# Altium schematic sheet ratopus.schdoc: RaToPUS DC/DC: Top Level Schematic
size A4; Organization: BE-CO-HT, CERN; Address1: Esplanade des Particules 1; Address2: 1217 Meyrin, Switzerland; Revision: 0.3; SheetNumber: 1; SheetTotal: 3; Author: Lalit Patnaik
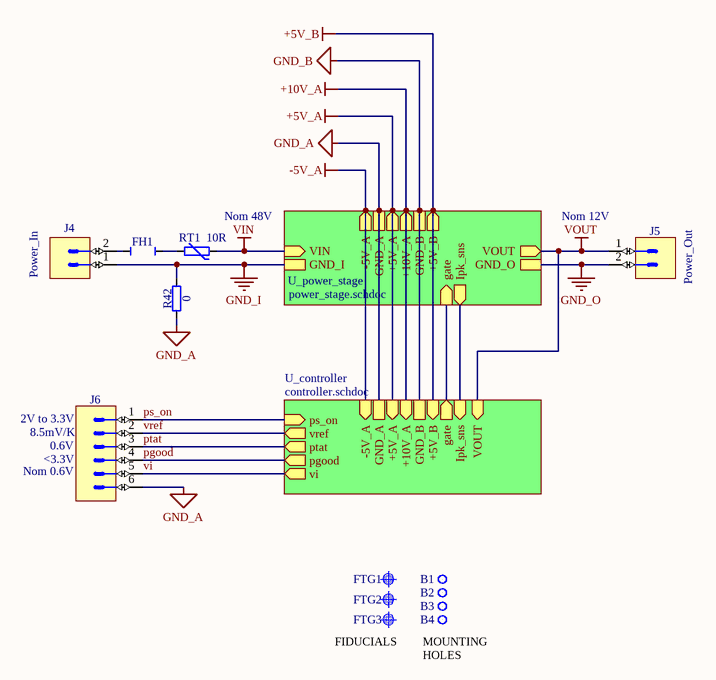
[diagram p0: ratopus.schdoc]

## Parts
B1  Non Plated Hole  [MTG270]  (value not drawn)
B2  Non Plated Hole  [MTG270]  (value not drawn)
B3  Non Plated Hole  [MTG270]  (value not drawn)
B4  Non Plated Hole  [MTG270]  (value not drawn)
FH1  Fuse Holder  [FUSH_SCHURTER_0031.7601]  (value not drawn)
FTG1  Use only in PCB  [FIDUCIAL_TOP_C100-200]  (value not drawn)
FTG2  Use only in PCB  [FIDUCIAL_TOP_C100-200]  (value not drawn)
FTG3  Use only in PCB  [FIDUCIAL_TOP_C100-200]  (value not drawn)
J4  (no value)  [PHOENIX_1755736]
J5  (no value)  [PHOENIX_1755736]
J6  Header 6  [JST_B6B-XH-A(LF)(SN)]  (value not drawn)
R42  0  [RESC2012X60N]
RT1  10R  [THERM_TDK_B57236S0]

## Sub-sheets
U_controller = controller.schdoc: VOUT (in), +5V_A (in), +5V_B (in), +10V_A (in), vref (out), ptat (out), pgood (out), vi (out), GND_A, ps_on (in), gate (out), -5V_A (in), Ipk_sns (in), GND_B
U_power_stage = power_stage.schdoc: gate (in), Ipk_sns (out), VIN (in), VOUT (out), +10V_A (out), -5V_A (out), GND_I, GND_O, GND_A, +5V_A (out), +5V_B (out), GND_B

## Nets
+5V_A: sheet U_power_stage/+5V_A, sheet U_controller/+5V_A
+5V_B: sheet U_power_stage/+5V_B, sheet U_controller/+5V_B
+10V_A: sheet U_power_stage/+10V_A, sheet U_controller/+10V_A
-5V_A: sheet U_power_stage/-5V_A, sheet U_controller/-5V_A
GND_A: J6.6 R42.1 ; sheet U_power_stage/GND_A, sheet U_controller/GND_A
GND_B: sheet U_power_stage/GND_B, sheet U_controller/GND_B
GND_I: J4.1 R42.2 ; sheet U_power_stage/GND_I
GND_O: J5.2 ; sheet U_power_stage/GND_O
VIN: RT1.2 ; sheet U_power_stage/VIN
VOUT: J5.1 ; sheet U_power_stage/VOUT, sheet U_controller/VOUT
pgood: J6.4 ; sheet U_controller/pgood
ps_on: J6.1 ; sheet U_controller/ps_on
ptat: J6.3 ; sheet U_controller/ptat
vi: J6.5 ; sheet U_controller/vi
vref: J6.2 ; sheet U_controller/vref
NetFH1_1: FH1.1 J4.2
NetFH1_2: FH1.2 RT1.1
(unnamed): sheet U_power_stage/gate, sheet U_controller/gate
(unnamed): sheet U_power_stage/Ipk_sns, sheet U_controller/Ipk_sns

Not connected (* = marked no-connect by the designer): B1 1; B2 1; B3 1; B4 1

## Notes on the sheet
- (near RT1) Nom 48V
- (near J5) Nom 12V
- (near J4) Power_In
- (near J5) Power_Out
- (near J6) 2V to 3.3V
- (near J6) 8.5mV/K
- (near J6) 0.6V
- (near J6) Nom 0.6V
- (near J6) <3.3V
- (near FTG3) FIDUCIALS
- (near B4) MOUNTING HOLES
- Title
- Size:
- Date:
- A4
- Number:
- Time:
- Revision:
- Sheet
- of
- File:

## Library data of the parts
B1-B4 = NON-PLATED_HOLE2.7: Single Terminal Socket; Part Description: Non Plated Through Hole: Hole Dia.=2.7mm; Mounted: No; Part Number: NON-PLATED_HOLE2.7; Component Kind: Standard (No BOM); Component Type: Standard (No BOM); Pin Count: 1; Family: Non Plated Hole; Socket: No; SMD: No; Sense: No; Status: None; ComponentHeight: 0mm; HelpURL: Undefined; Author: CERN DEM BC; CreateDate: 11/11/2015; LatestRevisionDate: 11/11/2015; PackageDescription: Non Plated Through Hole: Hole Dia.=2.7mm
FH1 = FUSH_SCHURTER_0031.7601: Part Description: Vertical Fuse Holder For D8.5 x H8.5mm Subminiature Fuses; PressFit: No; Part Number: FUSH_SCHURTER_0031.7601; Component Kind: Standard; Component Type: Standard; Pin Count: 2; PackageDescription: Vertical Fuse Holder For D8.5x H 8.5mm Subminiature Fuses; Family: Fuse Holder; Mounted: Yes; Socket: No; SMD: No; Sense: No; Manufacturer: SCHURTER; Manufacturer Part Number: 0031.7601; ComponentHeight: 4.4mm; HelpURL: \\cern.ch\dfs\Applications\Altium\Datasheets\FUSH_SCHURTER_0031.7601.pdf; Author: CERN DEM JLC; CreateDate: 12/09/2012; LatestRevisionDate: 12/09/2012
FTG1-FTG3 = FIDUCIAL_TARGET_C100-200: Fiducial Target; Part Description: Round Fiducial Target, Top Layer, 1.0mm, Top Solder 2.0mm, Keepout =2.0mm; Mounted: No; Part Number: FIDUCIAL_TARGET_C100-200; Component Kind: Standard (No BOM); Component Type: Standard (No BOM); Pin Count: 1; Family: Fiducial; Socket: No; SMD: Yes; Sense: No; Status: None; ComponentHeight: 0mm; HelpURL: Undefined; Author: CERN DEM JLC; CreateDate: 09/02/2010; LatestRevisionDate: 04/04/2012; PackageDescription: Round Fiducial Target, Top Layer, 1.0mm, Top Solder 2.0mm, Keepout =2.0mm
J4 J5 = PHOENIX_1755736: Connector 2 Male; Part Description: 12A, 250V, Pitch 5.08mm, 2 Positions Header; Manufacturer: PHOENIX CONTACT; Manufacturer Part Number: 1755736 (MSTBVA 2,5/2-G-5,08); PressFit: No; Part Number: PHOENIX_1755736; Component Kind: Standard; Component Type: Standard; Pin Count: 2; Mounted: Yes; Socket: No; SMD: No; Sense: No; Status: None; ComponentHeight: 12mm; HelpURL: \\cern.ch\dfs\Applications\Altium\Datasheets\PHOENIX_1755736.pdf; Author: CERN DEM JLC; CreateDate: 07/12/2010; LatestRevisionDate: 07/12/2010
J6 = JST_B6B-XH-A(LF)(SN): Connector 6 Male; Part Description: 6 Contacts, 2.5mm Pitch, Top Entry Type Shrouded Header; Manufacturer: JST (JAPAN SOLDERLESS TERMINALS); PressFit: No; Part Number: JST_B6B-XH-A(LF)(SN); Component Kind: Standard; Component Type: Standard; Pin Count: 6; Family: Header 6; Mounted: Yes; Socket: No; SMD: No; Sense: No; Status: None; Manufacturer Part Number: B6B-XH-A(LF)(SN); ComponentHeight: 7mm; HelpURL: \\cern.ch\dfs\Applications\Altium\Datasheets\JST_B6B-XH-A(LF)(SN).pdf; Author: CERN DEM JLC; CreateDate: 26/06/2014; LatestRevisionDate: 26/06/2014
R42 = R0805_0R_JUMPER: Resistor; Part Description: 2A (0.05R Max DC Resistance) Zero Ohm Jumper; Manufacturer: GENERIC; Manufacturer1 Part Number: NRC10Z0; PressFit: No; Part Number: R0805_0R_JUMPER; Component Kind: Standard; Component Type: Standard; Pin Count: 2; Value: 0; Status: Preferred; Manufacturer Part Number: R0805_0R_JUMPER; Case: 0805; Mounted: Yes; Sense: No; Socket: No; SMD: Yes; Manufacturer1 Example: NIC COMPONENT; Manufacturer1 ComponentHeight: 0.6mm; HelpURL: \\cern.ch\dfs\Applications\Altium\Datasheets\R0805_NIC_NRC.pdf; Author: CERN DEM JLC; CreateDate: 03/12/2007; LatestRevisionDate: 13/03/2008
RT1 = THERM_NTC_10R_TDK_B57236S0100M000: Thermistor NTC (Negative Temperature Coefficient); Part Description: Radial Leaded NTC Thermistor For Inrush Current Limiting; Manufacturer: TDK; Power: 3.5A; Voltage: 230VAC; Tolerance: ±20%; Part Number: THERM_NTC_10R_TDK_B57236S0100M000; Component Kind: Standard; Component Type: Standard; Pin Count: 2; Value: 10R; Status: None; Manufacturer Part Number: B57236S0100M000; Mounted: Yes; Socket: No; SMD: No; Sense: No; ComponentHeight: 16mm; HelpURL: \\cern.ch\dfs\Applications\Altium\Datasheets\THERM_NTC_TDK_B57236S0100M000.pdf; Author: CERN DEM JLC; CreateDate: 12/09/2018; LatestRevisionDate: 12/09/2018